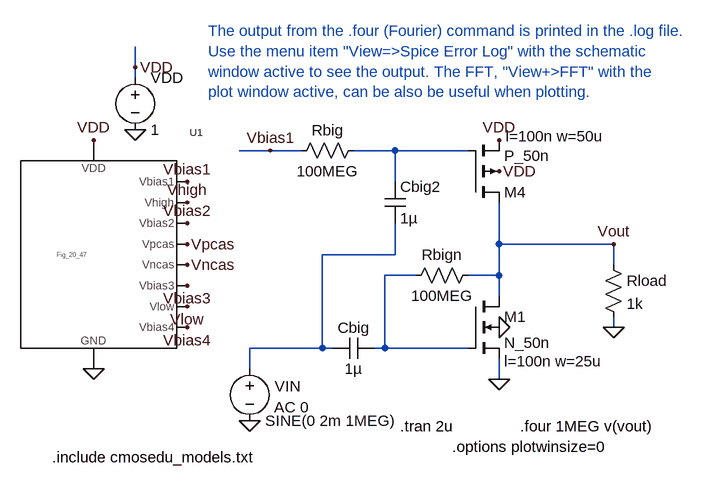
[diagram p0: schematic Fig21_56.asc]
Fig21_56.asc, the LTspice schematic file:
Version 4
SHEET 1 2500 680
WIRE 864 -352 864 -384
WIRE 864 -336 864 -352
WIRE 1072 -224 1024 -224
WIRE 1120 -224 1072 -224
WIRE 1264 -224 1200 -224
WIRE 1376 -224 1264 -224
WIRE 1264 -176 1264 -224
WIRE 1424 -80 1424 -144
WIRE 1600 -80 1424 -80
WIRE 1264 -64 1264 -112
WIRE 1264 -64 1152 -64
WIRE 1600 -48 1600 -80
WIRE 1296 -32 1248 -32
WIRE 1424 -32 1424 -80
WIRE 1424 -32 1376 -32
WIRE 1424 0 1424 -32
WIRE 1600 48 1600 32
WIRE 1152 80 1152 -64
WIRE 1152 80 1040 80
WIRE 1168 80 1152 80
WIRE 1248 80 1248 -32
WIRE 1248 80 1232 80
WIRE 1376 80 1248 80
WIRE 1040 112 1040 80
WIRE 1424 128 1424 96
FLAG 864 -256 0
FLAG 864 -352 VDD
FLAG 1424 48 0
FLAG 1424 128 0
FLAG 1600 48 0
FLAG 1424 -240 VDD
FLAG 1424 -192 VDD
FLAG 800 -240 VDD
FLAG 800 112 0
FLAG 944 -176 Vbias1
FLAG 944 -144 Vhigh
FLAG 944 -112 Vbias2
FLAG 944 -16 Vbias3
FLAG 944 -80 Vpcas
FLAG 944 -48 Vncas
FLAG 944 48 Vbias4
FLAG 944 16 Vlow
FLAG 1040 192 0
FLAG 1600 -80 Vout
FLAG 1072 -224 Vbias1
SYMBOL voltage 864 -352 R0
WINDOW 123 0 0 Left 2
WINDOW 39 0 0 Left 2
SYMATTR InstName VDD
SYMATTR Value 1
SYMBOL nmos4 1376 0 R0
WINDOW 123 56 100 Left 2
SYMATTR Value2 l=100n w=25u
SYMATTR InstName M1
SYMATTR Value N_50n
SYMBOL pmos4 1376 -144 M180
WINDOW 123 58 102 Left 2
WINDOW 0 56 16 Left 2
SYMATTR Value2 l=100n w=50u
SYMATTR InstName M4
SYMATTR Value P_50n
SYMBOL Fig_20_47 800 -64 R0
SYMATTR InstName U1
SYMBOL voltage 1040 96 R0
WINDOW 0 39 43 Left 2
WINDOW 123 38 75 Left 2
WINDOW 39 0 0 Left 2
SYMATTR InstName VIN
SYMATTR Value2 AC 0
SYMATTR Value SINE(0 2m 1MEG)
SYMBOL res 1280 -16 R270
WINDOW 0 32 56 VTop 2
WINDOW 3 0 56 VBottom 2
SYMATTR InstName Rbign
SYMATTR Value 100MEG
SYMBOL res 1104 -208 R270
WINDOW 0 32 56 VTop 2
WINDOW 3 0 56 VBottom 2
SYMATTR InstName Rbig
SYMATTR Value 100MEG
SYMBOL cap 1168 96 R270
WINDOW 0 32 32 VTop 2
WINDOW 3 0 32 VBottom 2
SYMATTR InstName Cbig
SYMATTR Value 1µ
SYMBOL res 1584 -64 R0
SYMATTR InstName Rload
SYMATTR Value 1k
SYMBOL cap 1248 -176 R0
SYMATTR InstName Cbig2
SYMATTR Value 1µ
TEXT 736 248 Left 2 !.include cmosedu_models.txt
TEXT 976 -408 Left 2 ;The output from the .four (Fourier) command is printed in the .log file.  \nUse the menu item "View=>Spice Error Log" with the schematic \nwindow active to see the output. The FFT, "View+>FFT" with the \nplot window active, can be also be useful when plotting.
TEXT 1272 200 Left 2 !.tran 2u
TEXT 1456 200 Left 2 !.four 1MEG v(vout)
TEXT 1352 232 Left 2 !.options plotwinsize=0

The netlist it stands for:
* Fig21_56.asc
VDD VDD 0 1
M1 Vout N003 0 0 N_50n l=100n w=25u
M4 Vout N001 VDD VDD P_50n l=100n w=50u
XU1 Vbias1 Vhigh Vbias2 Vpcas Vncas Vbias3 Vlow Vbias4 VDD 0 Fig_20_47  ; pins Vbias1 Vhigh Vbias2 Vpcas Vncas Vbias3 Vlow Vbias4 VDD GND
VIN N002 0 SINE(0 2m 1MEG) AC 0
Rbign N003 Vout 100MEG
Rbig Vbias1 N001 100MEG
Cbig N002 N003 1µ
Rload Vout 0 1k
Cbig2 N001 N002 1µ
.model NMOS NMOS
.model PMOS PMOS
.lib standard.mos
.include cmosedu_models.txt
* The output from the .four (Fourier) command is printed in the .log file.
* Use the menu item "View=>Spice Error Log" with the schematic
* window active to see the output. The FFT, "View+>FFT" with the
* plot window active, can be also be useful when plotting.
.tran 2u
.four 1MEG v(vout)
.options plotwinsize=0
.backanno
.end